# EAGLE design transmitter_board_single_panel_ (EAGLE 9.2.2)
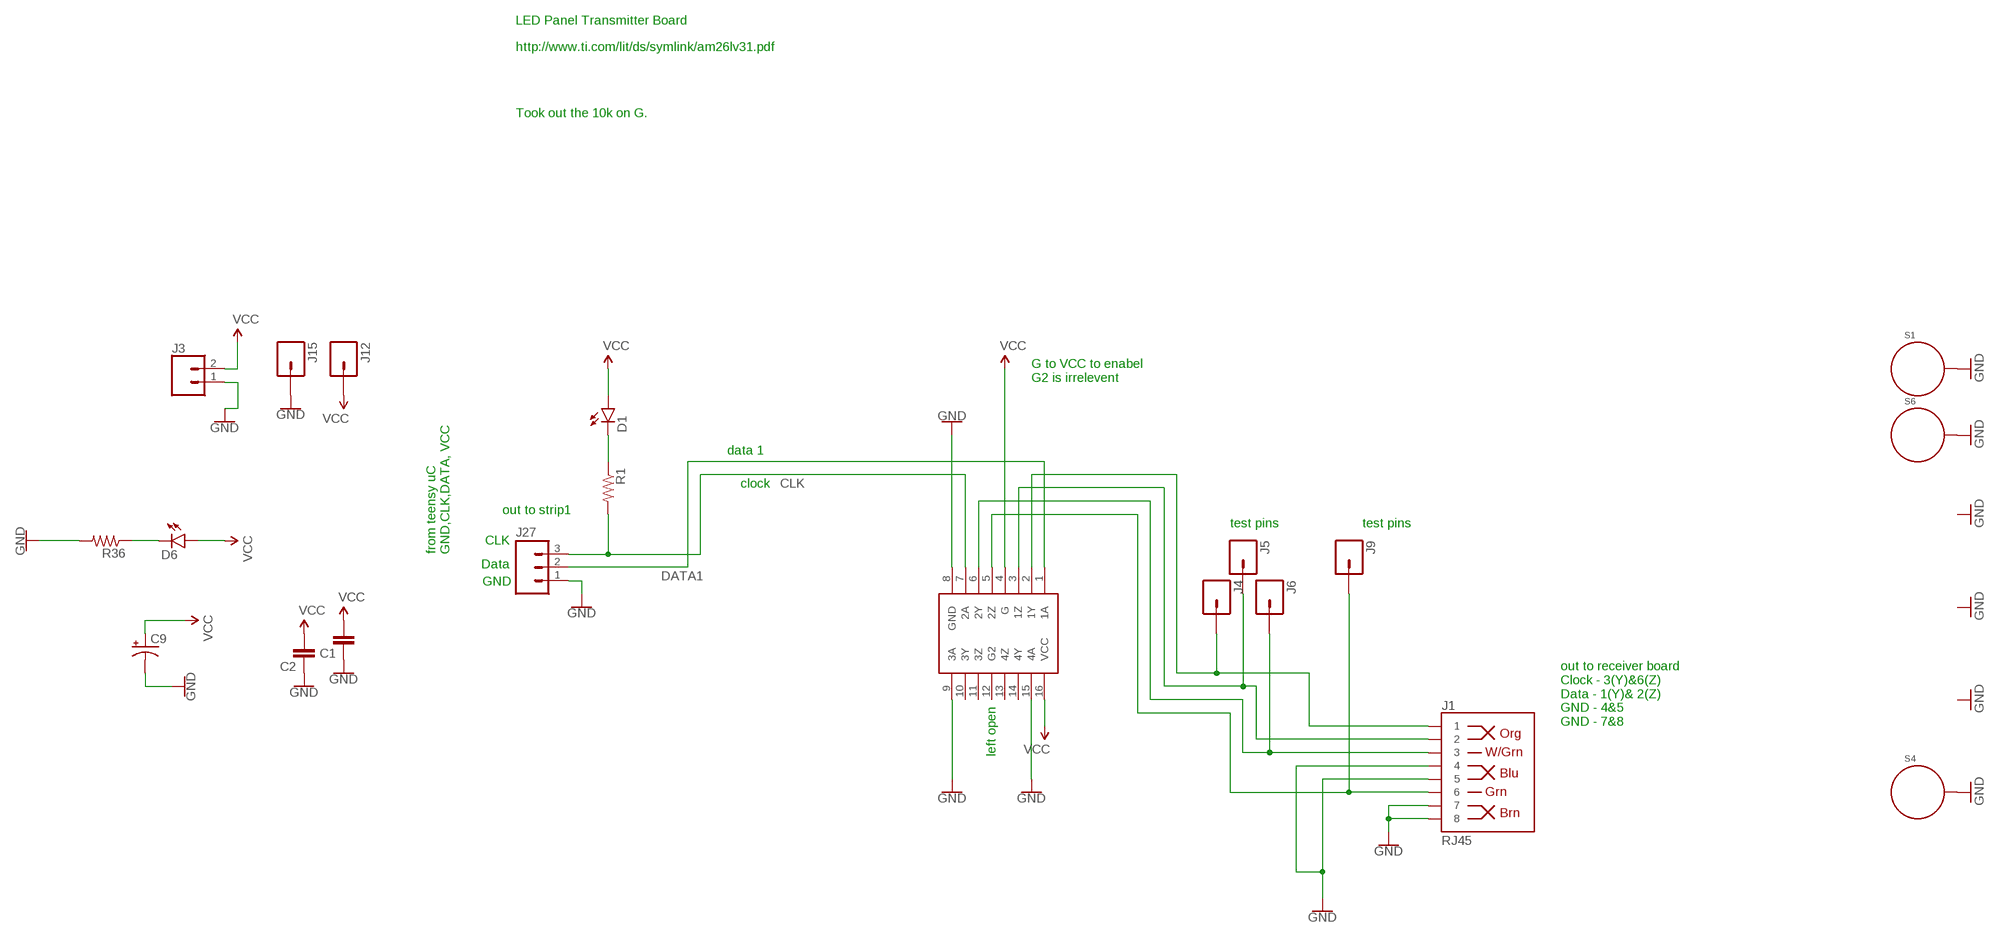
[diagram p0: schematic, sheet 1]

## Parts
C1  CAP0805  [0805]
C2  CAP0805  [0805]
C9  CAP_POLPTH1  [CPOL-RADIAL-100UF-25V]
D1  LED3MM  [LED3MM]
D6  LED3MM  [LED3MM]
J1  RJ45  RJ45-8  [RJ45-8]
J3  CONN_025MM  [SCREWTERMINAL-5MM-2]
J4  M01PTH  [1X01]
J5  M01PTH  [1X01]
J6  M01PTH  [1X01]
J9  M01PTH  [1X01]
J12  M01PTH  [1X01]
J15  M01PTH  [1X01]
J27  M03SCREW  [SCREWTERMINAL-3.5MM-3]
R1  RESISTOR0805-RES  [0805]
R36  RESISTOR0805-RES  [0805]
S1  STANDOFF_ELECTRICAL5-32  [STANDOFF_ELECTRICAL_5_32]
S4  STANDOFF_ELECTRICAL5-32  [STANDOFF_ELECTRICAL_5_32]
S6  STANDOFF_ELECTRICAL5-32  [STANDOFF_ELECTRICAL_5_32]
U$1  AM26LV31_QUAD_LINE_DRIVER  [SO016]

## Nets
CLK: J27.3 R1.2 U$1.7(2A)
DATA1: J27.2 U$1.1(1A)
GND: C1.1 C2.1 C9.2(-) J1.4 J1.5 J1.7 J1.8 J3.1 J15.1 J27.1 R36.2 S1.P1 S4.P1 S6.P1 U$1.8(GND) U$1.9(3A) U$1.15(4A)
N$1: J1.1 J4.1 U$1.2(1Y)
N$2: J1.2 J5.1 U$1.3(1Z)
N$3: J1.3 J6.1 U$1.6(2Y)
N$4: J1.6 J9.1 U$1.5(2Z)
N$5: D1.K(C) R1.1
N$58: D6.K(C) R36.1
VCC: C1.2 C2.2 C9.1(+) D1.A D6.A J3.2 J12.1 U$1.4(G) U$1.16(VCC)
Unconnected: U$1.10(3Y) U$1.11(3Z) U$1.12(G2) U$1.13(4Z) U$1.14(4Y)

## Notes on the sheet
- LED Panel Transmitter Board
- http://www.ti.com/lit/ds/symlink/am26lv31.pdf
- Took out the 10k on G.
- G to VCC to enabel
  G2 is irrelevent
- data 1
- clock
- out to strip1
- test pins | test pins
- CLK
- from teensy uC
  GND,CLK,DATA, VCC
- Data
- GND
- out to receiver board
  Clock - 3(Y)&6(Z)
  Data - 1(Y)& 2(Z)
  GND - 4&5
  GND - 7&8
- left open

## Library data of the parts
C1 C2 = SparkFun-Passives:CAP: Capacitor Standard 0603 ceramic capacitor, and 0.1" leaded capacitor.
C9 = SparkFun-Passives:CAP_POL: Capacitor Polarized These are standard SMD and PTH capacitors. Normally 10uF, 47uF, and 100uF in electrolytic and tantalum varieties. Always verify the external diameter of the through hole cap, it varies with capacity, voltage, and manufacturer. The EIA devices should be standard.
D1 D6 = SparkFun-LED:LED: LEDs Standard schematic elements and footprints for 5mm, 3mm, 1206, and 0603 sized LEDs. 5mm - Spark Fun Electronics SKU : COM-00529 (and others); PROD_ID: DIO-08794
J1 = SparkFun-Connectors:RJ45-8: RJ45 Jack - 8 pin Simple RJ45, 8-pin connection. Commonly used for Cat5, Cat5e, and Cat6 Ethernet cables. Here is the connector we sell at SparkFun: RJ45 8-Pin Connector <https://www.sparkfun.com/products/643> (PRT-00643) Datasheet <https://cdn.sparkfun.com/datasheets/Prototyping/04908.pdf> It is used on this SparkFun product: SparkFun RJ45 Breakout <https://www.sparkfun.com/products/716> (BOB-00716) Note, you may also be interested in the "MAGJACK" version of this. It is basically a RJ45 connector, but also has some status LEDs built into the connector housing. You can check that out in this library at the device named "MAGJACK.dev" and see these products online: RJ45 Ethernet MagJack-Compatible <https://www.sparkfun.com/products/8534> (PRT-08534) SparkFun RJ45 MagJack Breakout <https://www.sparkfun.com/products/13021> (BOB-13021); PROD_ID: CONN-08506; SF_ID: PRT-00643
J3 = SparkFun-Connectors:CONN_02: Multi connection point. Often used as Generic Header-pin footprint for 0.1 inch spaced/style header connections On any of the 0.1 inch spaced packages, you can populate with these: Break Away Headers - Straight <https://www.sparkfun.com/products/116> (PRT-00116) Break Away Male Headers - Right Angle <https://www.sparkfun.com/products/553> (PRT-00553) Female Headers <https://www.sparkfun.com/products/115> (PRT-00115) Break Away Headers - Machine Pin <https://www.sparkfun.com/products/117> (PRT-00117) Break Away Female Headers - Swiss Machine Pin <https://www.sparkfun.com/products/743> (PRT-00743) For SCREWTERMINALS and SPRING TERMINALS visit here: Screw Terimnals on SparkFun.com <https://www.sparkfun.com/search/results?term=Screw+Terminals> (5mm/3.5mm/2.54mm spacing) This device is also useful as a general connection point to wire up your design to another part of your project. Our various solder wires solder well into these plated through hole pads. Hook-Up Wire - Assortment (Stranded, 22 AWG) <https://www.sparkfun.com/products/11375> (PRT-11375) Hook-Up Wire - Assortment (Solid Core, 22 AWG) <https://www.sparkfun.com/products/11367> (PRT-11367) View the entire wire category on our website here <https://www.sparkfun.com/categories/141> Special notes: Molex polarized connector foot print use with: PRT-08233 with associated crimp pins and housings. 2.54_SCREWTERM for use with PRT-10571. 3.5mm Screw Terminal footprints for PRT-08084 5mm Screw Terminal footprints for use with PRT-08432; SF_SKU: PRT-08432
J4-J6 J9 J12 J15 = SparkFun-Connectors:M01: Header 1 Standard 1-pin 0.1" header. Use with straight break away headers (SKU : PRT-00116), right angle break away headers (PRT-00553), swiss pins (PRT-00743), machine pins (PRT-00117), and female headers (PRT-00115). SMTSO-256-ET is a "flush mount" nut for a 4-40 screw. The older package used to be too tight, and did not allow it to sit properly thru the drill hit. The latest (0.165DIA) fits nice and snug.
J27 = SparkFun-Connectors:M03: Header 3 Standard 3-pin 0.1" header. Use with straight break away headers (SKU : PRT-00116), right angle break away headers (PRT-00553), swiss pins (PRT-00743), machine pins (PRT-00117), and female headers (PRT-00115). Molex polarized connector foot print use with SKU : PRT-08232 with associated crimp pins and housings.; PROD_ID: CONN-08288
R1 R36 = SparkFun-Passives:RESISTOR: Resistor Basic schematic elements and footprints for 0603, 1206, and PTH resistors.
S1 S4 S6 = th_libraries:STANDOFF_ELECTRICAL: A standoff intended to be an electrically connected point. Pad size and stop size allow for a #8 Phillips pan screw head to make a solid connection to the board. Added 144mill drill hole that fits my normal wood screw
U$1 = welcome_wall:AM26LV31_QUAD_LINE_DRIVER

## Board
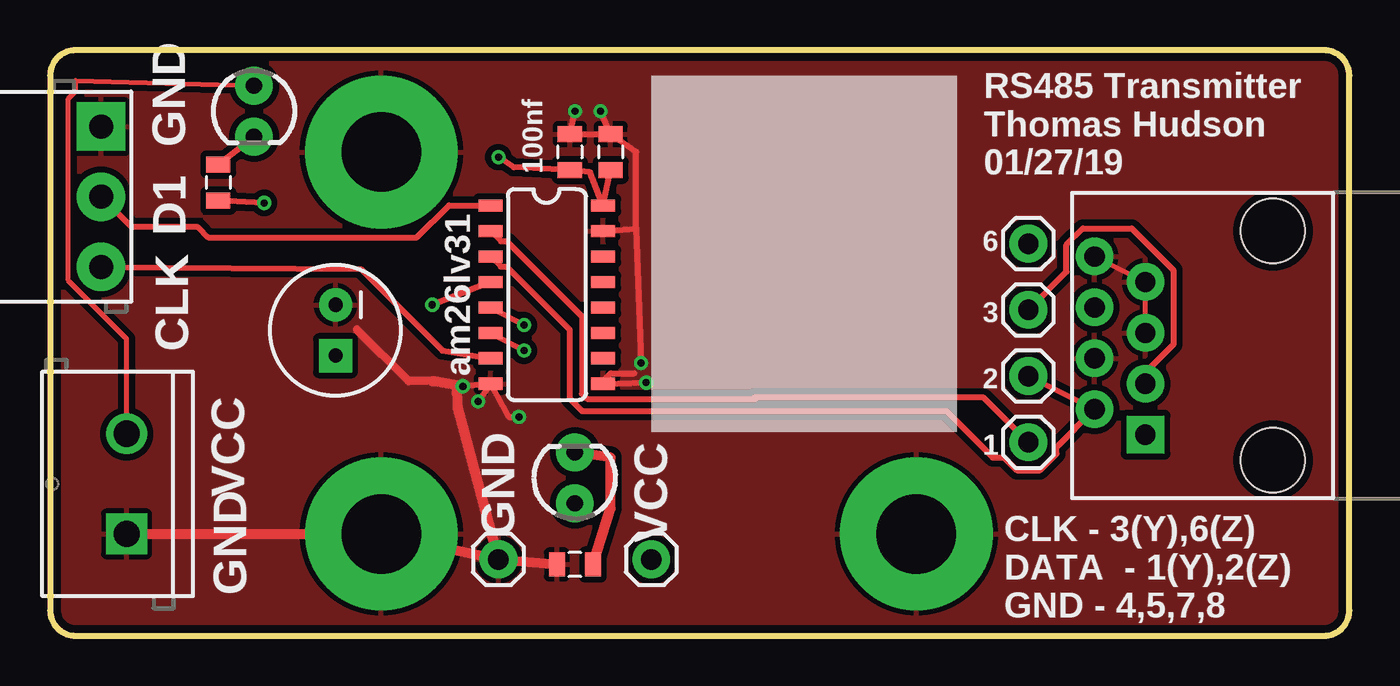
[diagram p1: board, top side]
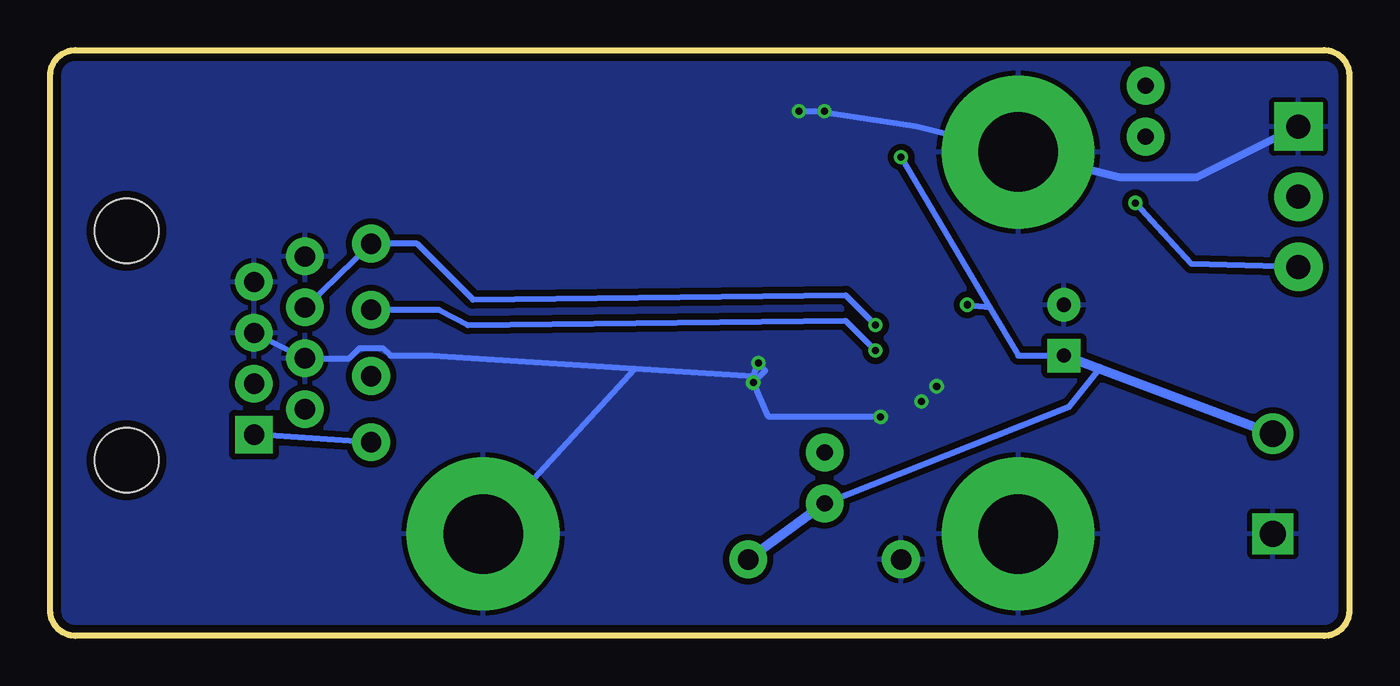
[diagram p2: board, bottom side, seen from below]

Size 64.77 x 29.21 mm. Coordinates in mm from the lower left corner, seen from the top.
Outline: 0,27.94 0,1.27 arc90 1.27,0 63.5,0 arc90 64.77,1.27 64.77,27.94 arc90 63.5,29.21 1.27,29.21 arc90 0,27.94
Copper layers (1*16): Top 0.0356mm / dielectric 1.5011mm / Bottom 0.0356mm
Design rules "oshpark-2layer *": minimum track width 10mil, minimum drill 13mil, track to track 12mil, track to pad 12mil, pad to pad 12mil, via to via 12mil, smd to smd 8mil, copper to edge 15mil, drill to drill 6mil, minimum pad ring 7mil, minimum via ring 7mil, stop-mask expansion 2.5mil, vias tented up to drill 25mil, thermal gap 10mil

### Footprints (pad centres in the part's own frame; a part is rotated, then mirrored left to right if it is on the bottom)
0805 = smd 0.8 x 1.2: 1 -0.9,0; 2 0.9,0
CPOL-RADIAL-100UF-25V = drill 0.7 pad 1.651 square: 1 1.27,0 | drill 0.7 pad 1.651: 2 -1.27,0
LED3MM = drill 0.813 pad 1.88: A -1.27,0; K 1.27,0
RJ45-8 = drill 1 pad 1.88 square: 1 -4.445,6.35 | drill 1 pad 1.88: 2 -3.175,8.89; 3 -1.905,6.35; 4 -0.635,8.89; 5 0.635,6.35; 6 1.905,8.89; 7 3.175,6.35; 8 4.445,8.89 | hole 3.2: -5.715,0; 5.715,0
SCREWTERMINAL-5MM-2 = drill 1.3 pad 2.032 square: 1 0,0 | drill 1.3 pad 2.032: 2 5,0
1X01 = drill 1.016 pad 1.88: 1 0,0
SCREWTERMINAL-3.5MM-3 = drill 1.2 pad 2.413 square: 1 0,0 | drill 1.2 pad 2.413: 2 3.5,0; 3 7,0
STANDOFF_ELECTRICAL_5_32 = drill 3.969 pad 7.62: P1 0,0
SO016 = smd 0.6 x 1.2: 1 -4.445,-2.8; 2 -3.175,-2.8; 3 -1.905,-2.8; 4 -0.635,-2.8; 5 0.635,-2.8; 6 1.905,-2.8; 7 3.175,-2.8; 8 4.445,-2.8; 9 4.445,2.8; 10 3.175,2.8; 11 1.905,2.8; 12 0.635,2.8; 13 -0.635,2.8; 14 -1.905,2.8; 15 -3.175,2.8; 16 -4.445,2.8

### Placement (x,y rotation side)
C1  25.91,24.13 270 top
C2  27.94,24.13 270 top
C9  14.22,15.24 270 top
D1  10.16,26.16 270 top
D6  26.16,7.87 90 top
J1  60.96,14.48 90 top
J3  3.81,5.08 90 top
J4  48.77,9.65 90 top
J5  48.77,12.95 90 top
J6  48.77,16.26 90 top
J9  48.77,19.56 90 top
J12  29.97,3.81 90 top
J15  22.35,3.81 90 top
J27  2.54,25.4 270 top
R1  8.38,22.61 270 top
R36  26.16,3.56 180 top
S1  16.51,5.08 0 top
S4  16.51,24.13 0 top
S6  43.18,5.08 0 top
U$1  24.77,17.02 270 top

### Tracks (layer width: path | path; a pad name or v marks a point on that pad's centre or on a via)
CLK  (via drill 0.35)
  Top 0.305: J27.3 15.49,18.29 19.56,14.22 U$1.7 | v10.67,21.59 R1.2
  Bottom 0.305: J27.3 7.87,18.54 v10.67,21.59
DATA1
  Top 0.305: J27.2 4.06,20.38 7.37,20.38 7.88,19.86 18.28,19.86 19.88,21.46 U$1.1
GND  (via drill 0.35)
  Top 0.254: J1.8 J1.7 J1.5
  Top 0.305: v26.16,26.16 C1.1 C2.1 | C2.1 v27.43,26.16 | v29.72,12.63 U$1.9 27.57,12.71 27.94,13.09 29.12,13.09 | U$1.8 v20.57,12.45 | U$1.8 v21.34,11.68 | U$1.15 29.21,20.32 | 29.21,20.32 29.21,24.13 C2.1 | 29.21,20.32 v29.46,13.6 | U$1.8 22.86,10.92 v23.37,10.92
  Top 0.406: 19.05,12.7 17.86,12.7 15.28,15.28
  Top 0.508: 20.29,12.49 19.05,12.7 | 20.29,12.49 v20.57,12.45 | J3.1 S1.P1 J15.1 | J15.1 R36.2 | J15.1 20.32,11.43 20.29,12.49
  Bottom 0.305: v27.43,26.16 26.67,26.16 | 26.67,26.16 v26.16,26.16 | S4.P1 21.59,25.4 26.67,26.16 | J1.5 J1.4 49.85,13.84 49.35,14.35 48.19,14.35 47.81,13.97 45.72,13.97 35.6,13.33 | 35.6,13.33 29.72,12.95 v29.46,13.6 29.11,13.23 v29.72,12.63 28.96,10.92 v23.37,10.92 | S6.P1 35.6,13.33
  Bottom 0.406: J27.1 7.62,22.86 11.43,22.86 S4.P1
  pour Bottom (isolate 0): 0,29.21 64.77,29.21 64.77,0 0,0
  pour Top (isolate 0): 0,30.48 66.04,30.48 66.04,0 0,0
N$1
  Top 0.305: U$1.2 22.48,19.68 22.75,19.68 26.51,15.93 26.51,12.08 26.78,11.82 35.17,11.82 35.1,11.89 46.53,11.89 J4.1
  Bottom 0.305: J4.1 J1.1
N$2
  Top 0.305: U$1.3 22.48,18.41 22.75,18.41 25.9,15.27 25.9,11.83 26.52,11.21 44.67,11.21 46.99,8.89 47.55,8.89 48.19,8.26 49.35,8.26 50.16,9.07 50.16,9.4 J1.2 J5.1
N$3  (via drill 0.35)
  Top 0.305: U$1.6 v23.62,14.22 | J6.1 50.67,18.16 50.67,19.5 51.49,20.32 53.92,20.32 56.01,18.23 56.01,14.53 54.61,13.14 J1.3
  Bottom 0.305: v23.62,14.22 25.12,15.72 43.94,15.49 45.38,16.26 J6.1
N$4  (via drill 0.35)
  Top 0.305: U$1.5 v23.62,15.49
  Bottom 0.305: v23.62,15.49 25.12,16.99 43.69,16.76 46.48,19.56 J9.1 J1.6
N$5
  Top 0.305: R1.1 D1.K
N$58
  Top 0.508: R36.1 27.94,6.35 27.94,8.89 D6.K
VCC  (via drill 0.35)
  Top 0.254: J3.2 3.81,14.81 0.9,17.72 0.9,26.79 1.27,27.15 1.27,27.69 D1.A
  Top 0.305: C2.2 U$1.16 26.92,23.11 C1.2 23.11,23.37 v22.35,23.88 | U$1.4 v19.05,16.51
  Bottom 0.305: v22.35,23.88 17.95,16.41 | 17.95,16.41 16.51,13.97 C9.1 | D6.A 13.97,11.43 12.47,13.32 | v19.05,16.51 17.95,16.41
  Bottom 0.508: J3.2 12.47,13.32 C9.1 | J12.1 D6.A

### Text on the board
tPlace: GND | D1 | 100nf | RS485 Transmitter / Thomas Hudson / 01/27/19 | am26lv31 | CLK | 6 | 3 | 2 | VCC | GND | VCC | 1 | GND | CLK - 3(Y),6(Z) / DATA - 1(Y),2(Z) / GND - 4,5,7,8